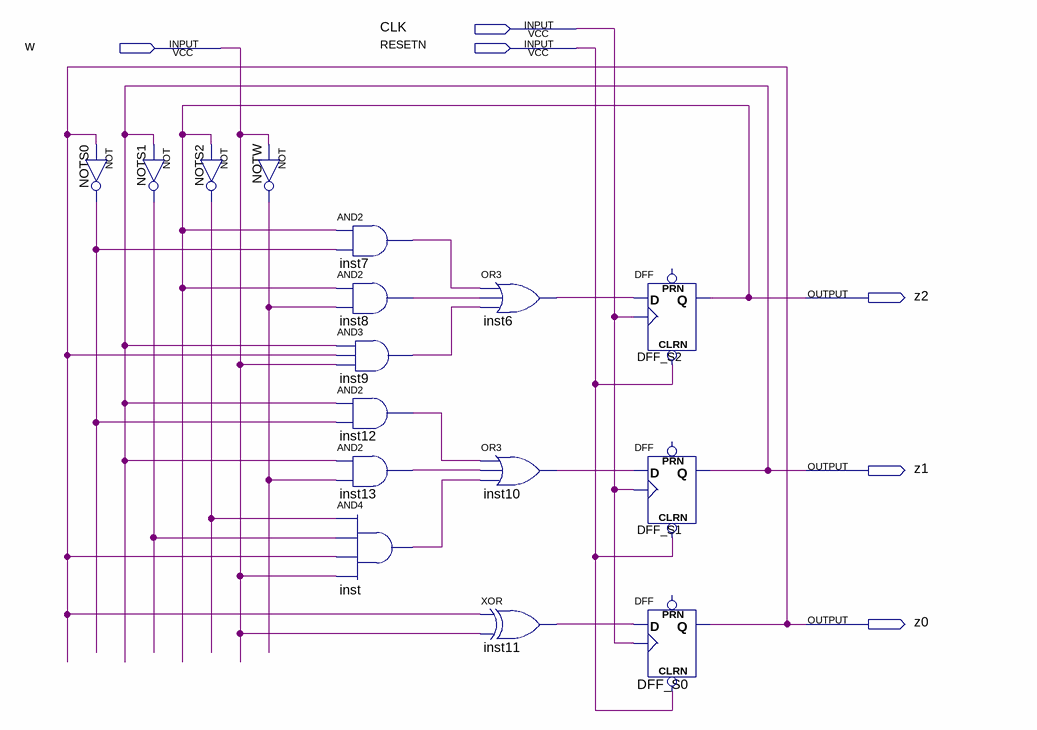
[diagram p0: schematic sheet]
// Quartus schematic Q3PcDesign.bdf as structural Verilog: 16 symbols, 6 pins
module Q3PcDesign (
  input  CLK,
  input  w,
  input  RESETN,
  output z2,
  output z1,
  output z0
);

  wire inst6_out, inst7_out, inst8_out, inst9_out, inst10_out, inst11_out, inst12_out, inst13_out, inst_out,
       NOTS0_out, NOTS1_out, NOTS2_out, NOTW_out;

  not NOTS0 (NOTS0_out, z0);
  not NOTS1 (NOTS1_out, z1);
  not NOTS2 (NOTS2_out, z2);
  not NOTW (NOTW_out, w);
  and inst7 (inst7_out, z2, NOTS0_out);
  and inst8 (inst8_out, z2, NOTW_out);
  and inst9 (inst9_out, z1, z0, w);
  and inst12 (inst12_out, z1, NOTS0_out);
  and inst13 (inst13_out, z1, NOTW_out);
  and inst (inst_out, NOTS2_out, NOTS1_out, z0, w);
  or inst6 (inst6_out, inst7_out, inst8_out, inst9_out);
  or inst10 (inst10_out, inst12_out, inst13_out, inst_out);
  xor inst11 (inst11_out, z0, w);
  DFF DFF_S2 (.CLRN(RESETN), .CLK(CLK), .D(inst6_out), .Q(z2));  // open: PRN
  DFF DFF_S1 (.CLRN(RESETN), .CLK(CLK), .D(inst10_out), .Q(z1));  // open: PRN
  DFF DFF_S0 (.CLRN(RESETN), .CLK(CLK), .D(inst11_out), .Q(z0));  // open: PRN
endmodule
